# EAGLE schematic hand_master_v0 (EAGLE 8.2.2)
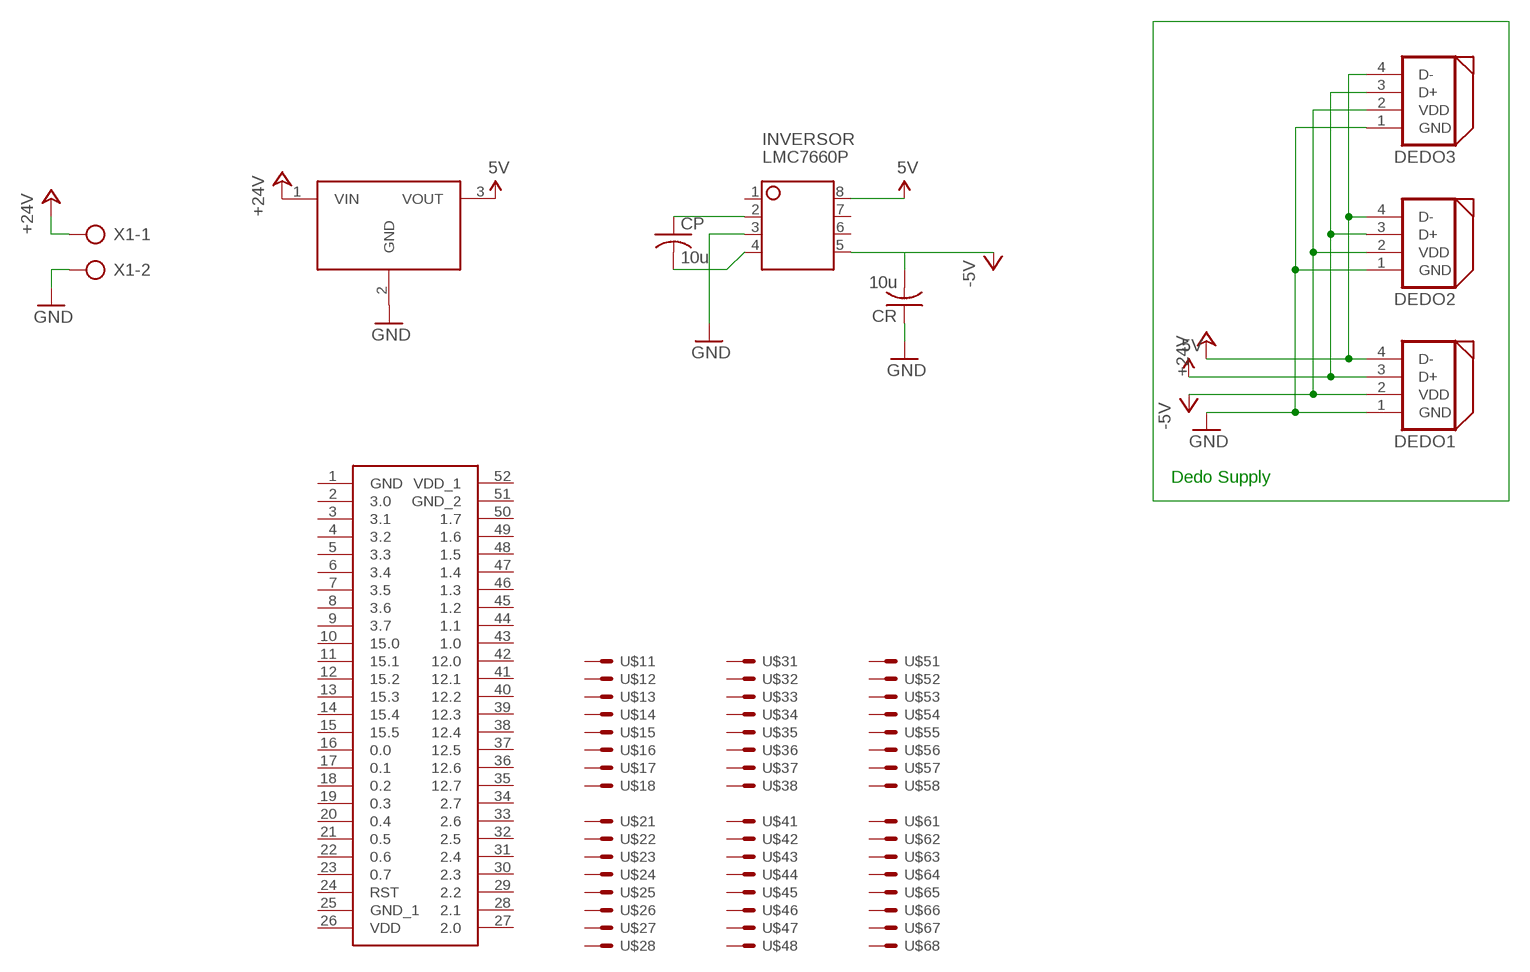
[diagram p0: schematic, sheet 1]

## Parts
CP  10u  C-US025-025X050  [C025-025X050]
CR  10u  C-US025-025X050  [C025-025X050]
DEDO1  DYNAMIXEL_RS485  [DYNAMIXEL_SPOX_04]
DEDO2  DYNAMIXEL_RS485  [DYNAMIXEL_SPOX_04]
DEDO3  DYNAMIXEL_RS485  [DYNAMIXEL_SPOX_04]
INVERSOR  LMC7660P  [DIL08]
POWER_SUPPLY  TSR-1  [TO220V]
U$1  JST8  [JST]
U$2  JST8  [JST]
U$3  JST8  [JST]
U$4  JST8  [JST]
U$5  JST8  [JST]
U$6  JST8  [JST]
U$7  CY8CKIT-059  [CY8CKIT-059]
X1  AK500/2  [AK500/2]

## Nets
5V: DEDO1.3(D+) DEDO2.3(D+) DEDO3.3(D+) INVERSOR.8(V+) POWER_SUPPLY.3(VOUT)
+24V: DEDO1.4(D-) DEDO2.4(D-) DEDO3.4(D-) POWER_SUPPLY.1(VIN) X1.1
-5V: CR.2 DEDO1.2(VDD) DEDO2.2(VDD) DEDO3.2(VDD) INVERSOR.5(VOUT)
GND: CR.1 DEDO1.1(GND) DEDO2.1(GND) DEDO3.1(GND) INVERSOR.3(GND) POWER_SUPPLY.2(GND) X1.2
N$2: CP.1 INVERSOR.2(CAP+)
N$3: CP.2 INVERSOR.4(CAP-)
Unconnected: INVERSOR.1(N/C) INVERSOR.6(LV) INVERSOR.7(OSC) U$1.1 U$1.2 U$1.3 U$1.4 U$1.5 U$1.6 U$1.7 U$1.8 U$2.1 U$2.2 U$2.3 U$2.4 U$2.5 U$2.6 U$2.7 U$2.8 U$3.1 U$3.2 U$3.3 U$3.4 U$3.5 U$3.6 U$3.7 U$3.8 U$4.1 U$4.2 U$4.3 U$4.4 U$4.5 U$4.6 U$4.7 U$4.8 U$5.1 U$5.2 U$5.3 U$5.4 U$5.5 U$5.6 U$5.7 U$5.8 U$6.1 U$6.2 U$6.3 U$6.4 U$6.5 U$6.6 U$6.7 U$6.8 U$7.1(GND) U$7.2(3.0) U$7.3(3.1) U$7.4(3.2) U$7.5(3.3) U$7.6(3.4) U$7.7(3.5) U$7.8(3.6) U$7.9(3.7) U$7.10(15.0) U$7.11(15.1) U$7.12(15.2) U$7.13(15.3) U$7.14(15.4) U$7.15(15.5) U$7.16(0.0) U$7.17(0.1) U$7.18(0.2) U$7.19(0.3) U$7.20(0.4) U$7.21(0.5) U$7.22(0.6) U$7.23(0.7) U$7.24(RST) U$7.25(GND_1) U$7.26(VDD) U$7.27(2.0) U$7.28(2.1) U$7.29(2.2) U$7.30(2.3) U$7.31(2.4) U$7.32(2.5) U$7.33(2.6) U$7.34(2.7) U$7.35(12.7) U$7.36(12.6) U$7.37(12.5) U$7.38(12.4) U$7.39(12.3) U$7.40(12.2) U$7.41(12.1) U$7.42(12.0) U$7.43(1.0) U$7.44(1.1) U$7.45(1.2) U$7.46(1.3) U$7.47(1.4) U$7.48(1.5) U$7.49(1.6) U$7.50(1.7) U$7.51(GND_2) U$7.52(VDD_1)

## Notes on the sheet
- Dedo Supply

## Library data of the parts
CP CR = resistor:C-US: CAPACITOR, American symbol
DEDO1-DEDO3 = mecatronica_eagle_lib:DYNAMIXEL_RS485: Dynamixel RS-485 Connector Molex LLC SPOX 4 Male connector Digikey code: WM18888-ND
INVERSOR = dedo:LMC7660
POWER_SUPPLY = dedo:TSR-1
U$1-U$6 = dedo:JST8
U$7 = dedo:CY8CKIT-059
X1 = con-ptr500:AK500/2: CONNECTOR; OC_FARNELL: unknown; OC_NEWARK: unknown